# Altium schematic sheet 28_Pins_Project_V1I2.SchDoc (part 1 of 3)
size A2; SheetNumber: 1; SheetTotal: 1
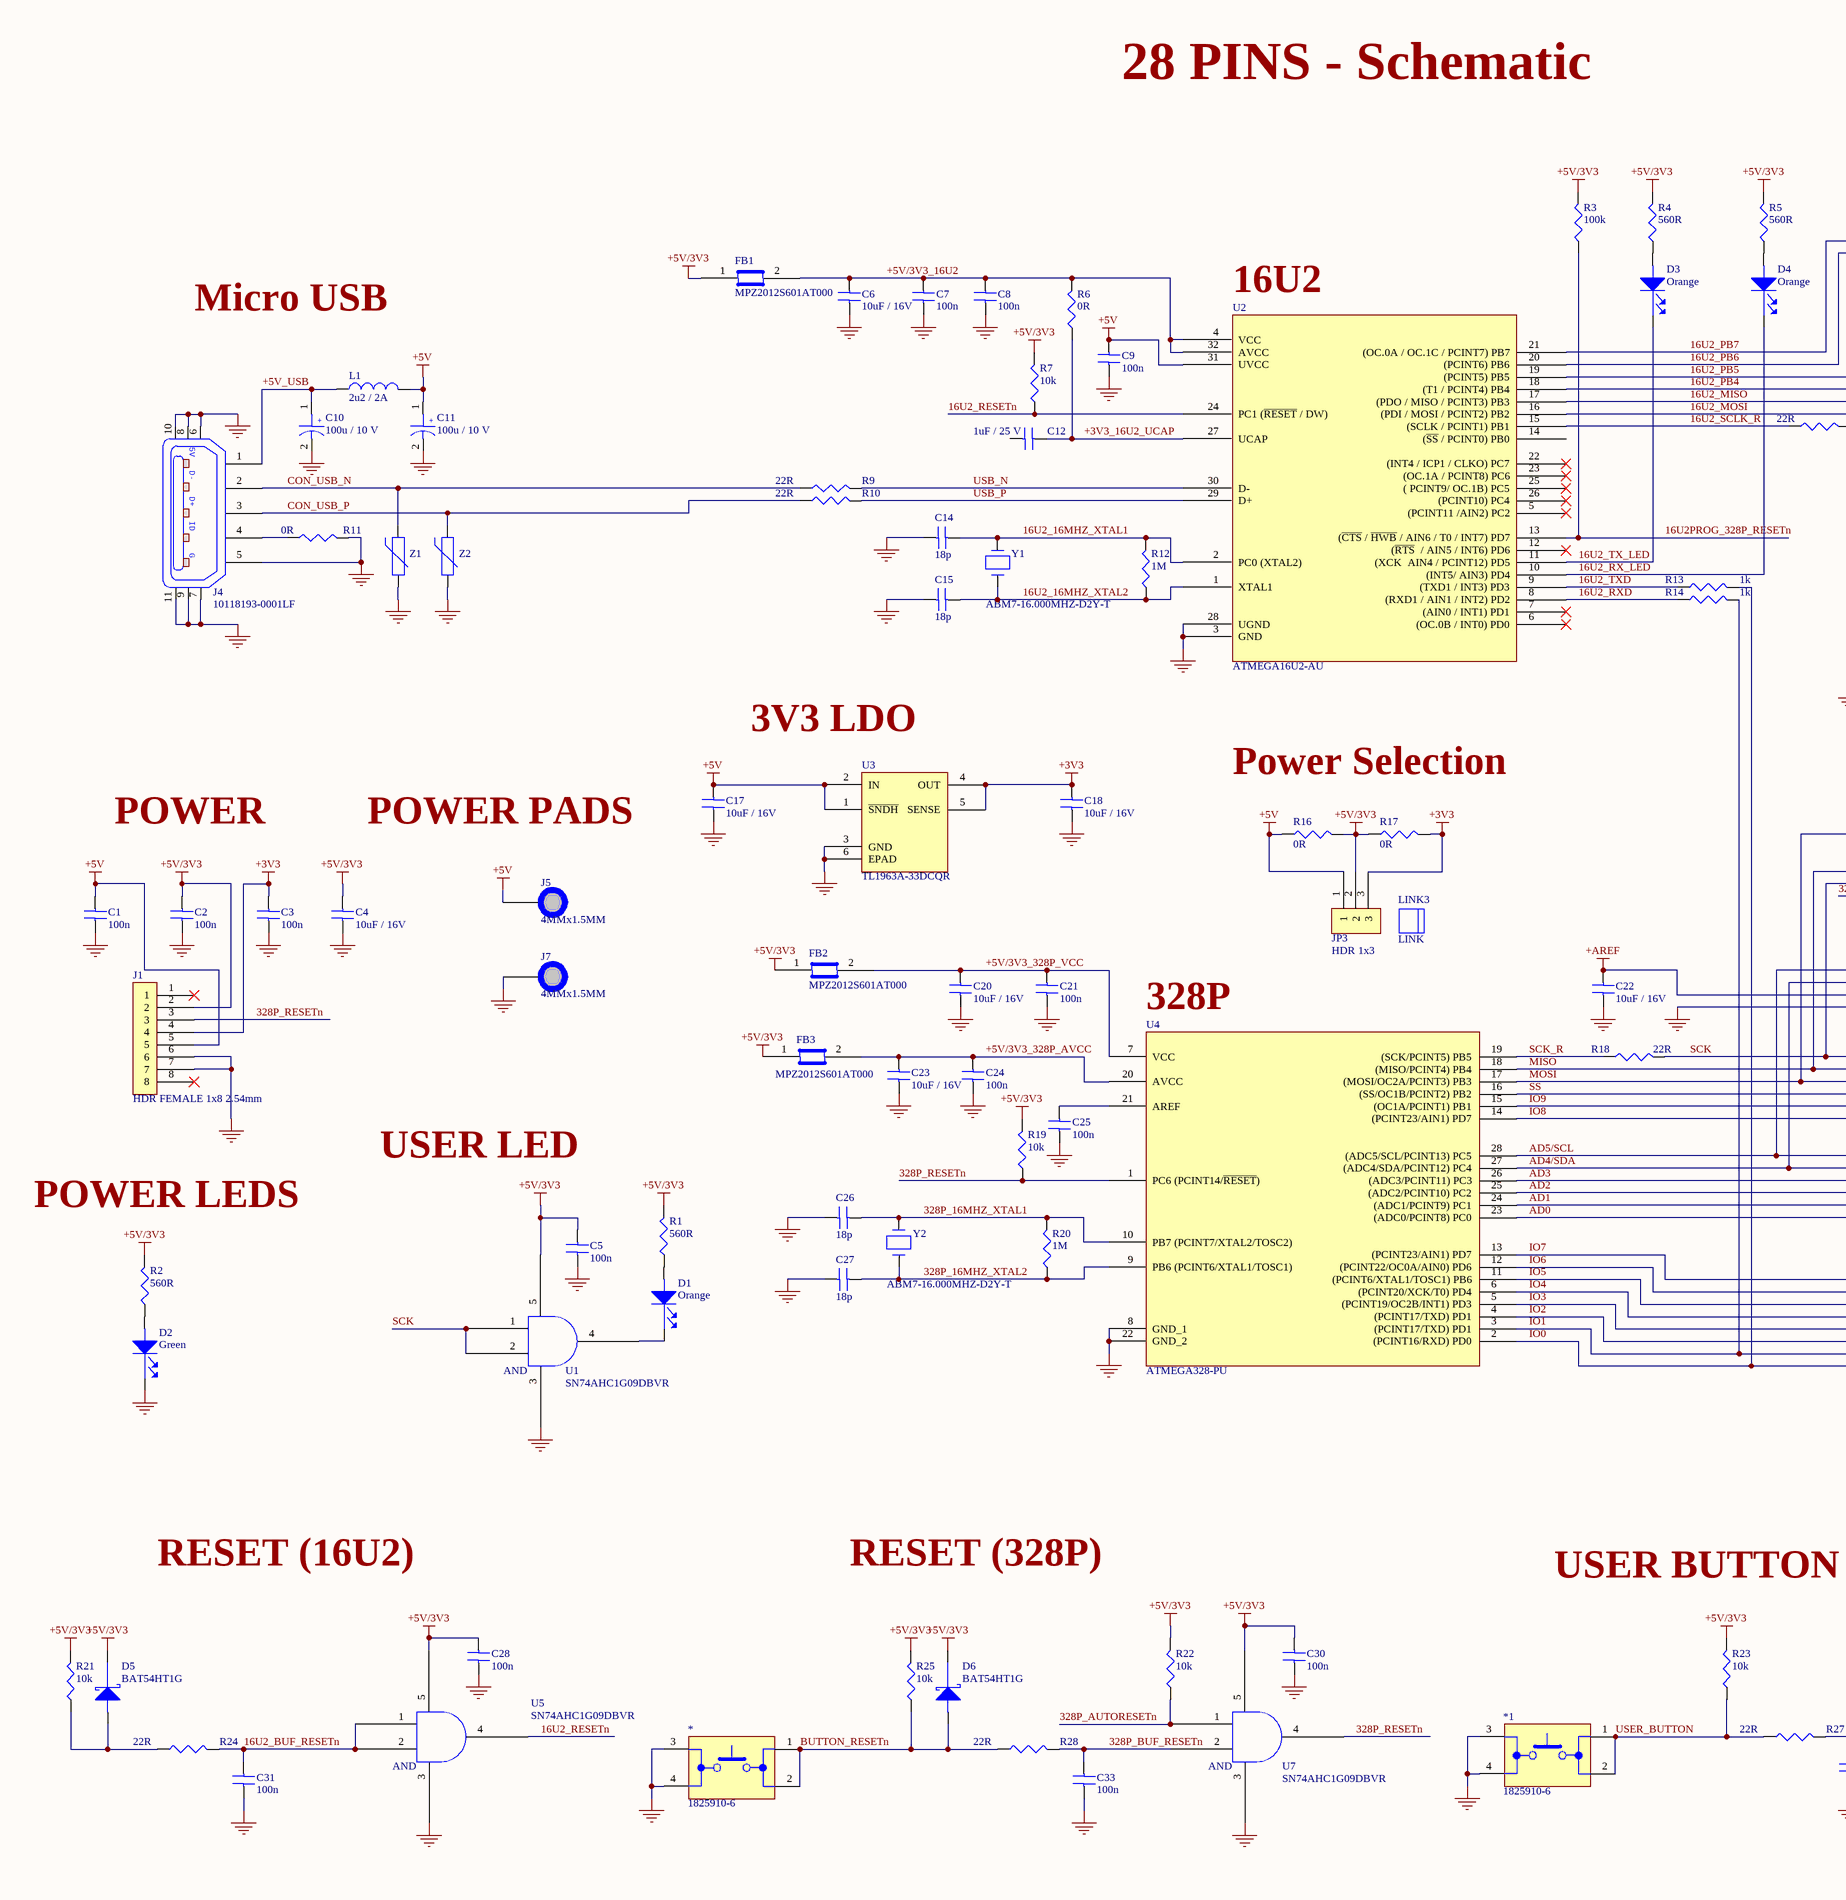
[diagram p0: 28_Pins_Project_V1I2.SchDoc, left]
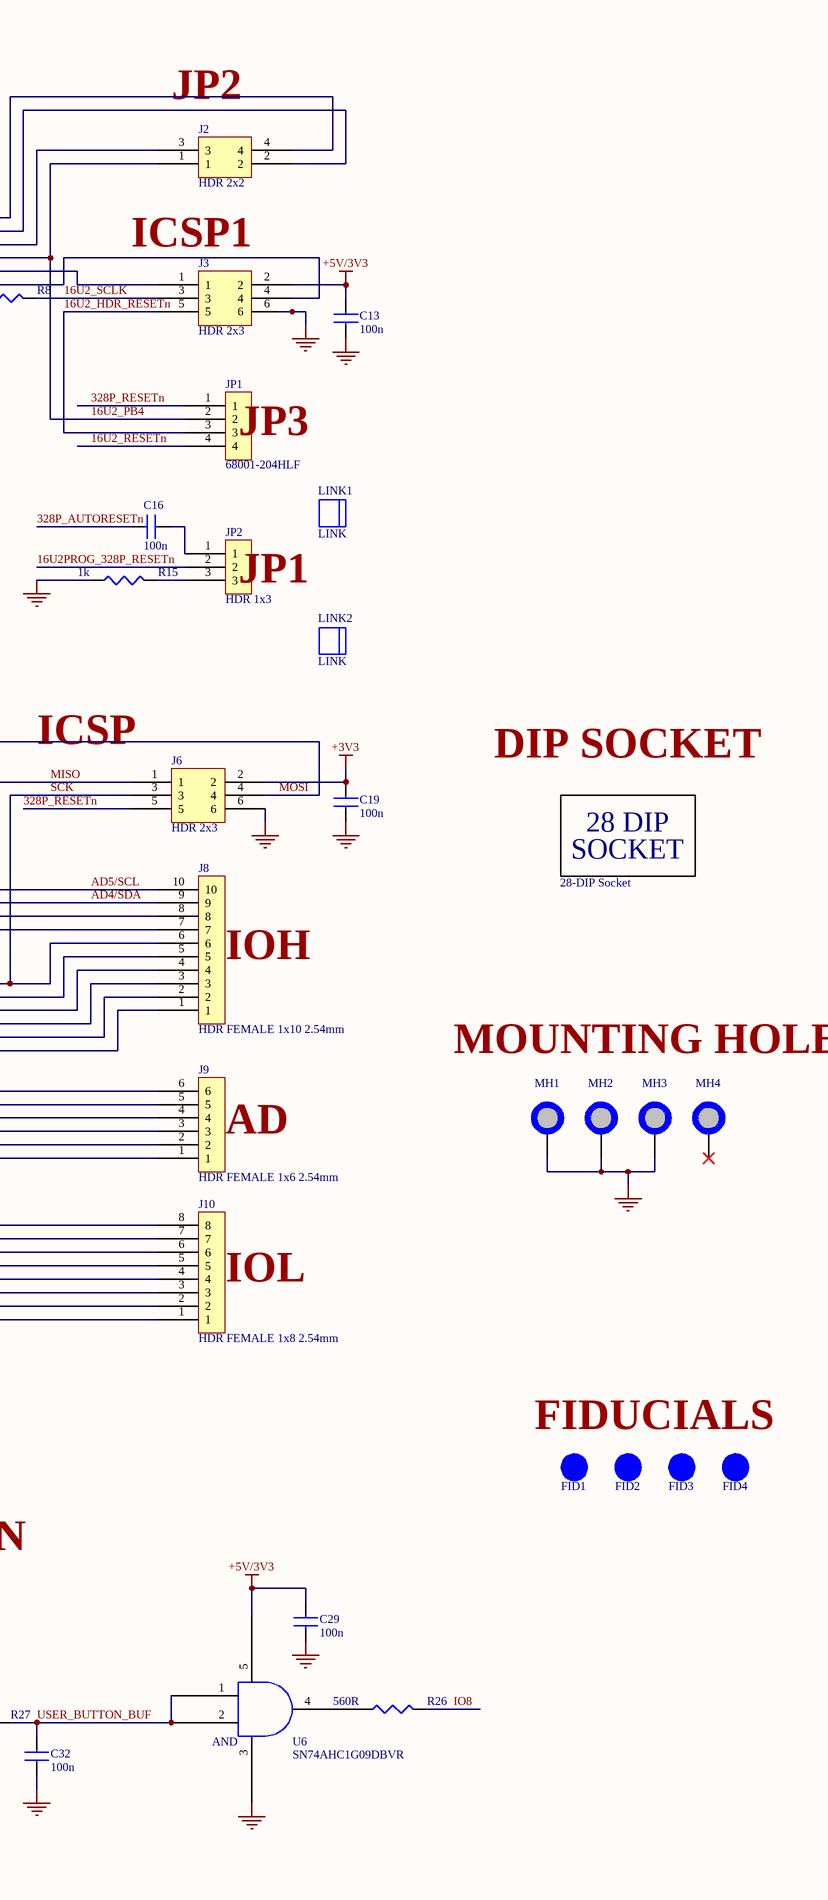
[diagram p1: 28_Pins_Project_V1I2.SchDoc, right]

## Parts
*  1825910-6  [1825910-6]
*1  1825910-6  [1825910-6]
C1  100n  [C0805]
C2  100n  [C0805]
C3  100n  [C0805]
C4  10uF / 16V  [C0805]
C5  100n  [C0805]
C6  10uF / 16V  [C0805]
C7  100n  [C0805]
C8  100n  [C0805]
C9  100n  [C0805]
C10  100u / 10 V  [C_ALU_C_SIZE]
C11  100u / 10 V  [C_ALU_C_SIZE]
C12  1uF / 25 V  [C0805]
C13  100n  [C0805]
C14  18p  [C0805]
C15  18p  [C0805]
C16  100n  [C0805]
C17  10uF / 16V  [C0805]
C18  10uF / 16V  [C0805]
C19  100n  [C0805]
C20  10uF / 16V  [C0805]
C21  100n  [C0805]
C22  10uF / 16V  [C0805]
C23  10uF / 16V  [C0805]
C24  100n  [C0805]
C25  100n  [C0805]
C26  18p  [C0805]
C27  18p  [C0805]
C28  100n  [C0805]
C29  100n  [C0805]
C30  100n  [C0805]
C31  100n  [C0805]
C32  100n  [C0805]
C33  100n  [C0805]
D1  Orange  [LED_0603]
D2  Green  [LED_0603]
D3  Orange  [LED_0603]
D4  Orange  [LED_0603]
D5  BAT54HT1G  [SOD323]
D6  BAT54HT1G  [SOD323]
FB1  MPZ2012S601AT000  [C0805]
FB2  MPZ2012S601AT000  [C0805]
FB3  MPZ2012S601AT000  [C0805]
FID1  FID_1MMC  [FID_40X120D]  (value not drawn)  (no BOM)
FID2  FID_1MMC  [FID_40X120D]  (value not drawn)  (no BOM)
FID3  FID_1MMC  [FID_40X120D]  (value not drawn)  (no BOM)
FID4  FID_1MMC  [FID_40X120D]  (value not drawn)  (no BOM)
J1  HDR FEMALE 1x8 2.54mm  [Hdr_Female_1x8_2.54mm]
J2  HDR 2x2  [HDR 2x2 2.54mm]
J3  HDR 2x3  [HDR 2x3 2.54mm]
J4  10118193-0001LF  [10118193]
J5  4MMx1.5MM  [PAD_WITH_HOLE_4MMx1.5MM]  (no BOM)
J6  HDR 2x3  [HDR 2x3 2.54mm]
J7  4MMx1.5MM  [PAD_WITH_HOLE_4MMx1.5MM]  (no BOM)
J8  HDR FEMALE 1x10 2.54mm
J9  HDR FEMALE 1x6 2.54mm  [Hdr_Female_1x6_2.54mm]
J10  HDR FEMALE 1x8 2.54mm  [Hdr_Female_1x8_2.54mm]
JP1  68001-204HLF  [Hdr_Female_1x4_2.54mm]
JP2  HDR 1x3  [Hdr_Female_1x3_2.54mm]
JP3  HDR 1x3  [Hdr_Female_1x3_2.54mm]
L1  2u2 / 2A  [C1210_IND]
LINK1  LINK  (mechanical)
LINK2  LINK  (mechanical)
LINK3  LINK  (mechanical)
MH1  MH_7.4MMNC_3.2MMD  [MH_7.4MMD_3.2MMD_NON_COPPER_NPTH]  (value not drawn)  (no BOM)
MH2  MH_7.4MMNC_3.2MMD  [MH_7.4MMD_3.2MMD_NON_COPPER_NPTH]  (value not drawn)  (no BOM)
MH3  MH_7.4MMNC_3.2MMD  [MH_7.4MMD_3.2MMD_NON_COPPER_NPTH]  (value not drawn)  (no BOM)
MH4  MH_7.4MMNC_3.2MMD  [MH_7.4MMD_3.2MMD_NON_COPPER_NPTH]  (value not drawn)  (no BOM)
R1  560R  [R0805]
R2  560R  [R0805]
R3  100k  [R0805]
R4  560R  [R0805]
R5  560R  [R0805]
R6  0R  [R0805]
R7  10k
R8  22R  [R0805]
R9  22R  [R0805]
R10  22R  [R0805]
R11  0R  [R0805]
R12  1M  [R0805]
R13  1k  [R0805]
R14  1k  [R0805]
R15  1k  [R0805]
R16  0R  [R0805]
R17  0R  [R0805]
R18  22R  [R0805]
R19  10k
R20  1M  [R0805]
R21  10k
R22  10k
R23  10k
R24  22R  [R0805]
R25  10k
R26  560R  [R0805]
R27  22R  [R0805]
R28  22R  [R0805]
SCKT_FOR_U1  28-DIP Socket  [28_DIP_7.62mm_SOCKET]
U1  SN74AHC1G09DBVR  [DBV_SOT_23_5 - duplicate]
U2  ATMEGA16U2-AU  [TQFP32]
U3  TL1963A-33DCQR  [DCQ (R-PDSO-G6)]
U4  ATMEGA328-PU  [28_DIP_7.62mm]
U5  SN74AHC1G09DBVR  [DBV_SOT_23_5 - duplicate]
U6  SN74AHC1G09DBVR  [DBV_SOT_23_5 - duplicate]
U7  SN74AHC1G09DBVR  [DBV_SOT_23_5 - duplicate]
Y1  ABM7-16.000MHZ-D2Y-T  [ABM7_v1_1_BIG]
Y2  ABM7-16.000MHZ-D2Y-T  [ABM7_v1_1_BIG]
Z1  CG0603MLC-05E  [R0603]  (value not drawn)
Z2  CG0603MLC-05E  [R0603]  (value not drawn)

## Nets
+3V3: C3.2 C18.2 C19.2 J1.4 J6.2 JP3.3 R17.2 U3.4(OUT) U3.5(SENSE)
+5V: C1.2 C9.2 C11.1 C17.2 J1.5 JP3.1 L1.2 R16.1 U2.31(UVCC) U3.1(~{SNDH}) U3.2(IN)
+5V/3V3: C2.2 C4.2 C5.2 C13.2 C28.2 C29.2 C30.2 D5.1(Cathode) D6.1(Cathode) FB1.1 FB2.1 FB3.1 J1.2 J3.2 JP3.2 R1.2 R2.2 R3.2 R4.2 R5.2 R7.2 R16.2 R17.1 R19.2 R21.2 R22.2 R23.2 R25.2 U1.5 U5.5 U6.5 U7.5
+AREF: C22.2 J8.8
GND: *.3 *.4 *1.3 *1.4 C1.1 C2.1 C3.1 C4.1 C5.1 C6.1 C7.1 C8.1 C9.1 C10.2 C11.2 C13.1 C14.1 C15.1 C17.1 C18.1 C19.1 C20.1 C21.1 C22.1 C23.1 C24.1 C25.1 C26.1 C27.1 C28.1 C29.1 C30.1 C31.1 C32.1 C33.1 D2.1(Cathode) J1.6 J1.7 J3.6 J4.5 J4.6 J4.7 J4.8 J4.9 J4.10 J4.11 J6.6 J8.7 MH1.1 MH2.1 MH3.1 R11.2 R15.1 U1.3 U2.3(GND) U2.28(UGND) U3.3(GND) U3.6(EPAD) U4.8(GND_1) U4.22(GND_2) U5.3 U6.3 U7.3 Z1.1 Z2.1
16U2_16MHZ_XTAL1: C14.2 R12.2 U2.2(PC0_(XTAL2)) Y1.2
16U2_16MHZ_XTAL2: C15.2 R12.1 U2.1(XTAL1) Y1.1
16U2_BUF_RESETn: C31.2 R24.2 U5.1 U5.2
16U2_HDR_RESETn: J3.5 JP1.3
16U2_MISO: J3.1 U2.17((PDO_/_MISO_/_PCINT3)_PB3)
16U2_MOSI: J3.4 U2.16((PDI_/_MOSI_/_PCINT2)_PB2)
16U2_PB4: J2.1 JP1.2 U2.18((T1_/_PCINT4)_PB4)
16U2_PB5: J2.3 U2.19((PCINT5)_PB5)
16U2_PB6: J2.2 U2.20((PCINT6)_PB6)
16U2_PB7: J2.4 U2.21((OC.0A_/_OC.1C_/_PCINT7)_PB7)
16U2_RESETn: JP1.4 R7.1 U2.24(PC1_(~{RESET}_/_DW)) U5.4
16U2_RX_LED: D4.1(Cathode) U2.10((INT5/_AIN3)_PD4)
16U2_RXD: R14.1 U2.8((RXD1_/_AIN1_/_INT2)_PD2)
16U2_SCLK: J3.3 R8.2
16U2_SCLK_R: R8.1 U2.15((SCLK_/_PCINT1)_PB1)
16U2_TX_LED: D3.1(Cathode) U2.11((XCK__AIN4_/_PCINT12)_PD5)
16U2_TXD: R13.1 U2.9((TXD1_/_INT3)_PD3)
16U2PROG_328P_RESETn: JP2.2 R3.1 U2.13((~{CTS}_/_~{HWB}_/_AIN6_/_T0_/_INT7)_PD7)
328P_16MHZ_XTAL1: C26.2 R20.2 U4.10(PB7_(PCINT7/XTAL2/TOSC2)) Y2.2
328P_16MHZ_XTAL2: C27.2 R20.1 U4.9(PB6_(PCINT6/XTAL1/TOSC1)) Y2.1
328P_AUTORESETn: C16.1 R22.1 U7.1
328P_BUF_RESETn: C33.2 R28.2 U7.2
328P_RESETn: J1.3 J6.5 JP1.1 R19.1 U4.1(PC6_(PCINT14/~{RESET})) U7.4
+3V3_16U2_UCAP: C12.2 R6.1 U2.27(UCAP)
+5V/3V3_16U2: C6.2 C7.2 C8.2 FB1.2 R6.2 U2.4(VCC) U2.32(AVCC)
+5V/3V3_328P_AVCC: C23.2 C24.2 FB3.2 U4.20(AVCC)
+5V/3V3_328P_VCC: C20.2 C21.2 FB2.2 U4.7(VCC)
+5V_USB: C10.1 J4.1 L1.1
AD0: J9.1 U4.23((ADC0/PCINT8)_PC0)
AD1: J9.2 U4.24((ADC1/PCINT9)_PC1)
AD2: J9.3 U4.25((ADC2/PCINT10)_PC2)
AD3: J9.4 U4.26((ADC3/PCINT11)_PC3)
AD4/SDA: J8.9 J9.5 U4.27((ADC4/SDA/PCINT12)_PC4)
AD5/SCL: J8.10 J9.6 U4.28((ADC5/SCL/PCINT13)_PC5)
BUTTON_RESETn: *.1 *.2 D6.2(Anode) R25.1 R28.1
CON_USB_N: J4.2 R9.1 Z1.2
CON_USB_P: J4.3 R10.1 Z2.2
IO0: J10.1 R13.2 U4.2((PCINT16/RXD)_PD0)
IO1: J10.2 R14.2 U4.3((PCINT17/TXD)_PD1)
IO2: J10.3 U4.4((PCINT17/TXD)_PD1)
IO3: J10.4 U4.5((PCINT19/OC2B/INT1)_PD3)
IO4: J10.5 U4.6((PCINT20/XCK/T0)_PD4)
IO5: J10.6 U4.11((PCINT6/XTAL1/TOSC1)_PB6)
IO6: J10.7 U4.12((PCINT22/OC0A/AIN0)_PD6)
IO7: J10.8 U4.13((PCINT23/AIN1)_PD7)
IO8: J8.1 R26.2 U4.14((PCINT23/AIN1)_PD7)
IO9: J8.2 U4.15((OC1A/PCINT1)_PB1)
MISO: J6.1 J8.5 U4.18((MISO/PCINT4)_PB4)
MOSI: J6.4 J8.4 U4.17((MOSI/OC2A/PCINT3)_PB3)
SCK: J6.3 J8.6 R18.2 U1.1 U1.2
SCK_R: R18.1 U4.19((SCK/PCINT5)_PB5)
SS: J8.3 U4.16((SS/OC1B/PCINT2)_PB2)
USB_N: R9.2 U2.30(D-)
USB_P: R10.2 U2.29(D+)
USER_BUTTON: *1.1 *1.2 R23.1 R27.1
USER_BUTTON_BUF: C32.2 R27.2 U6.1 U6.2
NetC16_2: C16.2 JP2.1
NetC25_2: C25.2 U4.21(AREF)
NetD1_1: D1.1(Cathode) U1.4
NetD1_2: D1.2(Anode) R1.1
NetD2_2: D2.2(Anode) R2.1
NetD3_2: D3.2(Anode) R4.1
NetD4_2: D4.2(Anode) R5.1
NetD5_2: D5.2(Anode) R21.1 R24.1
NetJ4_4: J4.4 R11.1
NetJP2_3: JP2.3 R15.2
NetR26_1: R26.1 U6.4

Not connected (* = marked no-connect by the designer): C12 1; J1 1* 8*; J5 1; J7 1; MH4 1*; U2 5((PCINT11_/AIN2)_PC2)* 6((OC.0B_/_INT0)_PD0)* 7((AIN0_/_INT1)_PD1)* 12((~{RTS}__/_AIN5_/_INT6)_PD6)* 14((~{SS}_/_PCINT0)_PB0) 22((INT4_/_ICP1_/_CLKO)_PC7)* 23((OC.1A_/_PCINT8)_PC6)* 25((_PCINT9/_OC.1B)_PC5)* 26((PCINT10)_PC4)*

## Notes on the sheet
- 28 PINS - Schematic
- (near J2) JP2
- Micro USB
- (near U2) 16U2
- (near J3) ICSP1
- (near JP1) JP3
- (near JP2) JP1
- 3V3 LDO
- Power Selection
- POWER
- POWER PADS
- ICSP
- DIP SOCKET
- (near U4) 328P
- (near J8) IOH
- MOUNTING HOLES
- USER LED
- POWER LEDS
- (near J9) AD
- (near J10) IOL
- FIDUCIALS
- RESET (16U2)
- RESET (328P)
- USER BUTTON
- (in symbol 4828-3004-CP) 28 DIP; SOCKET
- (in symbol 10118193-0001LF) 5V; D-; D+; ID; G
- (in symbol EEE-1AA101WR) +
- (in symbol SN74AHC1G09DBVR) AND